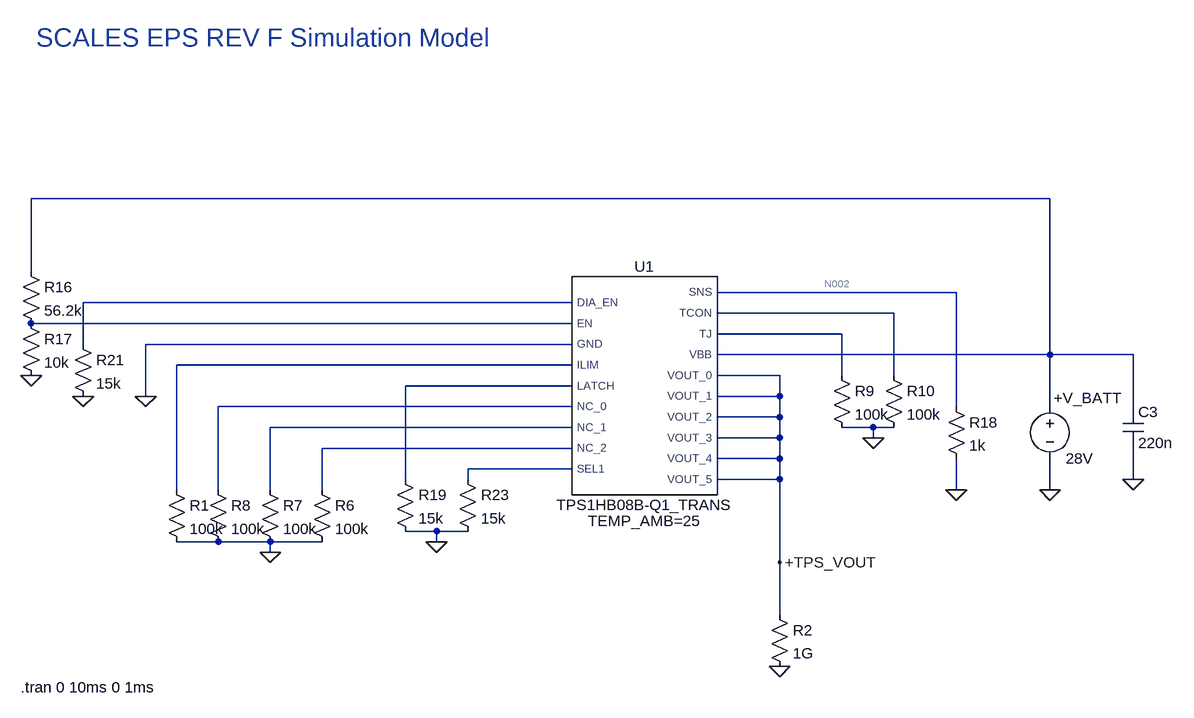
[diagram p0: schematic TPS1HB08_Sim.asc]
TPS1HB08_Sim.asc, the LTspice schematic file:
Version 4
SHEET 1 3140 1076
WIRE 736 -880 -832 -880
WIRE -832 -768 -832 -880
WIRE 592 -736 224 -736
WIRE 0 -720 -752 -720
WIRE 496 -704 224 -704
WIRE 0 -688 -832 -688
WIRE 416 -672 224 -672
WIRE -752 -656 -752 -720
WIRE 0 -656 -656 -656
WIRE 736 -640 736 -880
WIRE 736 -640 224 -640
WIRE 864 -640 736 -640
WIRE 0 -624 -608 -624
WIRE 320 -608 224 -608
WIRE 416 -608 416 -672
WIRE 496 -608 496 -704
WIRE 0 -592 -256 -592
WIRE -656 -576 -656 -656
WIRE 320 -576 320 -608
WIRE 320 -576 224 -576
WIRE 0 -560 -544 -560
WIRE 592 -560 592 -736
WIRE 736 -560 736 -640
WIRE 864 -560 864 -640
WIRE 320 -544 320 -576
WIRE 320 -544 224 -544
WIRE 0 -528 -464 -528
WIRE 464 -528 416 -528
WIRE 496 -528 464 -528
WIRE 320 -512 320 -544
WIRE 320 -512 224 -512
WIRE 464 -512 464 -528
WIRE 0 -496 -384 -496
WIRE 320 -480 320 -512
WIRE 320 -480 224 -480
WIRE 0 -464 -160 -464
WIRE -256 -448 -256 -592
WIRE -160 -448 -160 -464
WIRE 320 -448 320 -480
WIRE 320 -448 224 -448
WIRE 864 -448 864 -496
WIRE -608 -432 -608 -624
WIRE -544 -432 -544 -560
WIRE -464 -432 -464 -528
WIRE -384 -432 -384 -496
WIRE 592 -432 592 -480
WIRE 736 -432 736 -480
WIRE -208 -368 -256 -368
WIRE -160 -368 -208 -368
WIRE -544 -352 -608 -352
WIRE -464 -352 -544 -352
WIRE -384 -352 -464 -352
WIRE -208 -352 -208 -368
WIRE -464 -336 -464 -352
WIRE 320 -320 320 -448
WIRE 320 -240 320 -320
FLAG -752 -576 0
FLAG -832 -608 0
FLAG -208 -352 0
FLAG 736 -432 0
FLAG 592 -432 0
FLAG -464 -336 0
FLAG 464 -512 0
FLAG -656 -576 0
FLAG 864 -448 0
FLAG 320 -320 +TPS_VOUT
FLAG 320 -160 0
SYMBOL res -848 -704 R0
SYMATTR InstName R17
SYMATTR Value 10k
SYMBOL res -848 -784 R0
SYMATTR InstName R16
SYMATTR Value 56.2k
SYMBOL res -768 -672 R0
SYMATTR InstName R21
SYMATTR Value 15k
SYMBOL res -176 -464 R0
SYMATTR InstName R23
SYMATTR Value 15k
SYMBOL voltage 736 -576 R0
WINDOW 0 6 3 Left 2
SYMATTR InstName +V_BATT
SYMATTR Value 28V
SYMBOL res 576 -576 R0
SYMATTR InstName R18
SYMATTR Value 1k
SYMBOL res -400 -448 R0
SYMATTR InstName R6
SYMATTR Value 100k
SYMBOL res -480 -448 R0
SYMATTR InstName R7
SYMATTR Value 100k
SYMBOL res -560 -448 R0
SYMATTR InstName R8
SYMATTR Value 100k
SYMBOL res 400 -624 R0
SYMATTR InstName R9
SYMATTR Value 100k
SYMBOL res 480 -624 R0
SYMATTR InstName R10
SYMATTR Value 100k
SYMBOL res -624 -448 R0
SYMATTR InstName R1
SYMATTR Value 100k
SYMBOL res -272 -464 R0
SYMATTR InstName R19
SYMATTR Value 15k
SYMBOL cap 848 -560 R0
SYMATTR InstName C3
SYMATTR Value 220n
SYMBOL TPS1HB08B-Q1_TRANS 112 -592 R0
SYMATTR InstName U1
SYMBOL res 304 -256 R0
SYMATTR InstName R2
SYMATTR Value 1G
TEXT -824 -1128 Left 4 ;SCALES EPS REV F Simulation Model
TEXT -848 -128 Left 2 !.tran 0 10ms 0 1ms

The netlist it stands for:
* TPS1HB08_Sim.asc
R17 N005 0 10k
R16 N001 N005 56.2k
R21 N003 0 15k
R23 N012 0 15k
V§+V_BATT N001 0 28V
R18 N002 0 1k
R6 N011 0 100k
R7 N010 0 100k
R8 N009 0 100k
R9 N006 0 100k
R10 N004 0 100k
R1 N007 0 100k
R19 N008 0 15k
C3 N001 0 220n
XU1 N003 N005 0 N007 N008 N009 N010 N011 N012 N002 N004 N006 N001 +TPS_VOUT +TPS_VOUT +TPS_VOUT +TPS_VOUT +TPS_VOUT +TPS_VOUT TPS1HB08B-Q1_TRANS TEMP_AMB=25  ; pins DIA_EN EN GND ILIM LATCH NC_0 NC_1 NC_2 SEL1 SNS TCON TJ VBB VOUT_0 VOUT_1 VOUT_2 VOUT_3 VOUT_4 VOUT_5
R2 +TPS_VOUT 0 1G
* SCALES EPS REV F Simulation Model
.tran 0 10ms 0 1ms
.lib C:\Users\luqui\OneDrive\Documents\GitHub\scales-hardware\imx8x_eps_leviathan\simulation_models\ltSpice\TPS1HB08_sim\TPS1HB08B-Q1_TRANS.lib
.backanno
.end

* Results of the author's LTspice run, read from the files saved beside the schematic
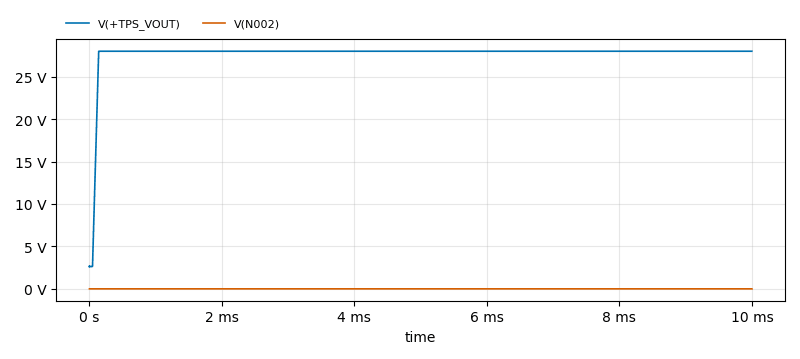
[diagram p1: Transient Analysis of TPS1HB08_Sim.asc, plotted from the saved traces]
* Transient Analysis, 1 run:
*   V(+TPS_VOUT): min 2.619 V, max 28 V, average 27.77 V, rms 27.85 V, last 28 V
*   V(N002): min 5.883 nV, max 11.55 nV, average 5.901 nV, rms 5.901 nV, last 5.901 nV